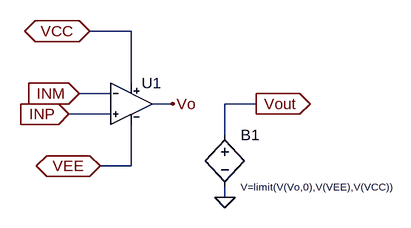
[diagram p0: schematic TLV9054_X.asc]
TLV9054_X.asc, the LTspice schematic file:
Version 4
SHEET 1 880 680
WIRE 192 48 128 48
WIRE 192 128 192 48
WIRE 160 144 112 144
WIRE 256 160 224 160
WIRE 384 160 336 160
WIRE 160 176 96 176
WIRE 336 208 336 160
WIRE 192 256 192 192
WIRE 192 256 144 256
WIRE 336 304 336 288
FLAG 384 160 Vout
IOPIN 384 160 Out
FLAG 128 48 VCC
IOPIN 128 48 BiDir
FLAG 144 256 VEE
IOPIN 144 256 BiDir
FLAG 112 144 INM
IOPIN 112 144 In
FLAG 96 176 INP
IOPIN 96 176 In
FLAG 336 304 0
FLAG 256 160 Vo
SYMBOL TLV9054 192 160 R0
SYMATTR InstName U1
SYMBOL bv 336 192 R0
WINDOW 3 24 96 Left 1
SYMATTR InstName B1
SYMATTR Value V=limit(V(Vo,0),V(VEE),V(VCC))

The netlist it stands for:
* TLV9054_X.asc
XU1 INP INM VCC VEE Vo TLV9054  ; pins IN+ IN- VCC VEE OUT
B1 Vout 0 V=limit(V(Vo,0),V(VEE),V(VCC))
.lib TLV9054.lib
.backanno
.end